# EAGLE design PhoneGimbal_v3 (EAGLE 9.6.2)
AUTHOR: RMCLAUGLHIN & MFROST; BOARD_NAME: GIMBAL; DOC_NUM: 02; PROJECT_NAME: 507_FINAL; REVISION: 02
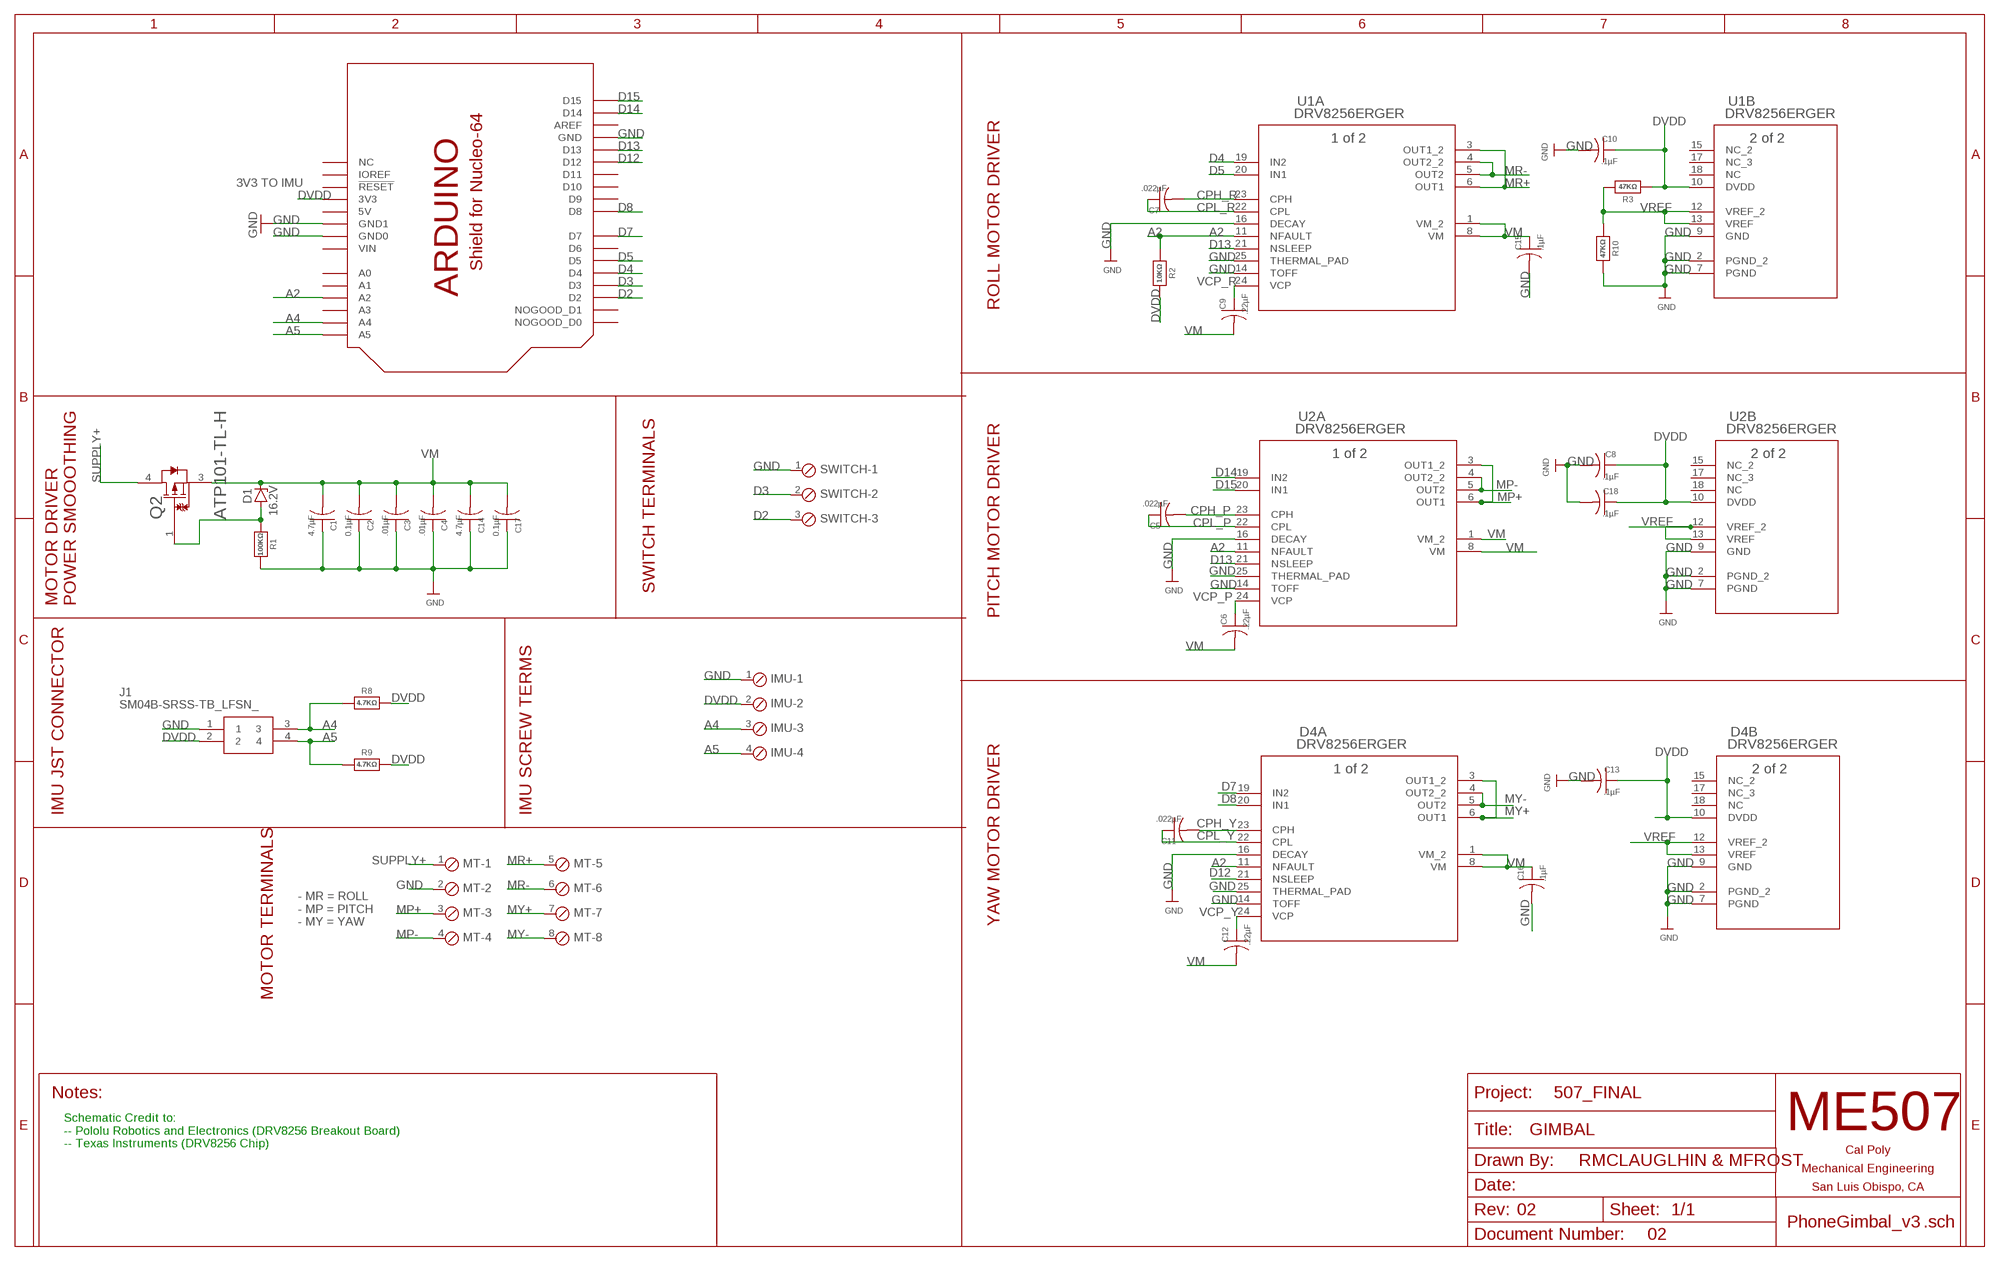
[diagram p0: schematic, sheet 1]

## Parts
C1  4.7µF  C-USC0805  [C0805]
C2  0.1µF  C-USC0805  [C0805]
C3  .01µF  C-USC0805  [C0805]
C4  .01µF  C-USC0805  [C0805]
C5  .022µF  C-USC0805  [C0805]
C6  .22µF  C-USC0805  [C0805]
C7  .022µF  C-USC0805  [C0805]
C8  .1µF  C-USC0805  [C0805]
C9  .22µF  C-USC0805  [C0805]
C10  .1µF  C-USC0805  [C0805]
C11  .022µF  C-USC0805  [C0805]
C12  .22µF  C-USC0805  [C0805]
C13  .1µF  C-USC0805  [C0805]
C14  4.7µF  C-USC0805  [C0805]
C15  .1µF  C-USC0805  [C0805]
C16  .1µF  C-USC0805  [C0805]
C17  0.1µF  C-USC0805  [C0805]
C18  .1µF  C-USC0805  [C0805]
D1  16.2V  ZENER-DIODEDO34-7  [DO34Z7]
D4  DRV8256ERGER  [VQFN_6PRGER_TEX]
IMU  SCREWTERM_4P_254  [4POL254]
J1  SM04B-SRSS-TB_LFSN_  [SM04B-SRSS-TB(LFSN)]
MT  SCREWTERM_8P_381  [8POL381]
Q2  ON_SEMICONDUCTOR_ATP101-TL-HON_SEMICONDUCTOR_ATP101-TL-H_0_0  [ON_SEMICONDUCTOR_ATP101-TL-H_0]
R1  100KΩ  RESISTOR_1206  [_1206]
R2  10KΩ  RESISTOR_1206  [_1206]
R3  47KΩ  RESISTOR_1206  [_1206]
R8  4.7KΩ  RESISTOR_1206  [_1206]
R9  4.7KΩ  RESISTOR_1206  [_1206]
R10  47KΩ  RESISTOR_1206  [_1206]
SWITCH  SCREWTERM_3P_254  [3POL254]
U1  DRV8256ERGER  [VQFN_6PRGER_TEX]
U2  DRV8256ERGER  [VQFN_6PRGER_TEX]
U$1  SHIELD_FOR_NUCLE0_64_STANDARD  [SHIELD_FOR_NUCLEO_64_STD]

## Nets
A2: D4.11(A:NFAULT) R2.1 U1.11(A:NFAULT) U2.11(A:NFAULT) U$1.A2
A4: IMU.3 J1.3 R8.1 U$1.A4
A5: IMU.4 J1.4 R9.1 U$1.A5
CPH_P: C5.2 U2.23(A:CPH)
CPH_R: C7.2 U1.23(A:CPH)
CPH_Y: C11.2 D4.23(A:CPH)
CPL_P: C5.1 U2.22(A:CPL)
CPL_R: C7.1 U1.22(A:CPL)
CPL_Y: C11.1 D4.22(A:CPL)
D2: SWITCH.3 U$1.D2
D3: SWITCH.2 U$1.D3
D4: U1.19(A:IN2) U$1.D4
D5: U1.20(A:IN1) U$1.D5
D7: D4.19(A:IN2) U$1.D7
D8: D4.20(A:IN1) U$1.D8
D12: D4.21(A:NSLEEP) U$1.D12
D13: U1.21(A:NSLEEP) U2.21(A:NSLEEP) U$1.D13
D14: U2.19(A:IN2) U$1.D14
D15: U2.20(A:IN1) U$1.D15
DVDD: C8.1 C10.1 C13.1 C18.1 D4.10(B:DVDD) IMU.2 J1.2 R2.2 R3.1 R8.2 R9.2 U1.10(B:DVDD) U2.10(B:DVDD) U$1.3V(3V3)
GND: C1.1 C2.1 C3.1 C4.1 C8.2 C10.2 C13.2 C14.1 C15.2 C16.2 C17.1 C18.2 D4.2(B:PGND_2) D4.7(B:PGND) D4.9(B:GND) D4.14(A:TOFF) D4.16(A:DECAY) D4.25(A:THERMAL_PAD) IMU.1 J1.1 MT.2 R1.2 R10.2 SWITCH.1 U1.2(B:PGND_2) U1.7(B:PGND) U1.9(B:GND) U1.14(A:TOFF) U1.16(A:DECAY) U1.25(A:THERMAL_PAD) U2.2(B:PGND_2) U2.7(B:PGND) U2.9(B:GND) U2.14(A:TOFF) U2.16(A:DECAY) U2.25(A:THERMAL_PAD) U$1.GND U$1.GND1(GND0) U$1.GND2(GND1)
MP+: MT.3 U2.3(A:OUT1_2) U2.6(A:OUT1)
MP-: MT.4 U2.4(A:OUT2_2) U2.5(A:OUT2)
MR+: MT.5 U1.3(A:OUT1_2) U1.6(A:OUT1)
MR-: MT.6 U1.4(A:OUT2_2) U1.5(A:OUT2)
MY+: D4.3(A:OUT1_2) D4.6(A:OUT1) MT.7
MY-: D4.4(A:OUT2_2) D4.5(A:OUT2) MT.8
N$1: D1.A Q2.1(G) R1.1
SUPPLY+: MT.1 Q2.4(D)
VCP_P: C6.1 U2.24(A:VCP)
VCP_R: C9.1 U1.24(A:VCP)
VCP_Y: C12.1 D4.24(A:VCP)
VM: C1.2 C2.2 C3.2 C4.2 C6.2 C9.2 C12.2 C14.2 C15.1 C16.1 C17.2 D1.C D4.1(A:VM_2) D4.8(A:VM) Q2.3(S) U1.1(A:VM_2) U1.8(A:VM) U2.1(A:VM_2) U2.8(A:VM)
VREF: D4.12(B:VREF_2) D4.13(B:VREF) R3.2 R10.1 U1.12(B:VREF_2) U1.13(B:VREF) U2.12(B:VREF_2) U2.13(B:VREF)
Unconnected: D4.15(B:NC_2) D4.17(B:NC_3) D4.18(B:NC) U1.15(B:NC_2) U1.17(B:NC_3) U1.18(B:NC) U2.15(B:NC_2) U2.17(B:NC_3) U2.18(B:NC) U$1.A0 U$1.A1 U$1.A3 U$1.AREF U$1.D0(NOGOOD_D0) U$1.D1(NOGOOD_D1) U$1.D6 U$1.D9 U$1.D10 U$1.D11 U$1.IOREF U$1.NC U$1.NRST(!RESET)

## Notes on the sheet
- 3V3 TO IMU
- ROLL MOTOR DRIVER
- SWITCH TERMINALS
- MOTOR DRIVER
  POWER SMOOOTHING
- PITCH MOTOR DRIVER
- IMU JST CONNECTOR | IMU SCREW TERMS
- - MR = ROLL
  - MP = PITCH
  - MY = YAW
- YAW MOTOR DRIVER
- MOTOR TERMINALS
- Schematic Credit to:
  -- Pololu Robotics and Electronics (DRV8256 Breakout Board)
  -- Texas Instruments (DRV8256 Chip)

## Power pins joined to a net without a drawn wire
5V: U$1.5V
VIN: U$1.VIN

## Library data of the parts
C1-C18 = rcl:C-US: CAPACITOR, American symbol; SPICEPREFIX: C
D1 = diode:ZENER-DIODE: Z-Diode
D4 U1 U2 = DRV8256_TI:DRV8256ERGER; BUILT_BY: EMA_Matt; COPYRIGHT: Copyright (C) 2018 Accelerated Designs. All rights reserved; DATASHEET: https://www.ti.com/lit/ds/symlink/drv8256.pdf?ts=1624033284390&ref_url=https%253A%252F%252Fwww.google.com%252F; MANUFACTURER_PART_NUMBER: DRV8256ERGER; SOURCELIBRARY: Add_to_database_2021-06-21; VENDOR: Texas Instruments
IMU = ME507_1:SCREWTERM_4P: Screw Terminal Block This part is designed for a screw terminal connector. The 2.54mm (0.100 inch) foorprint can also be used for male or female pin headers such as those on most development boards. One can also solder wires directly into the holes, though this makes modifications or repairs to the system more inconvenient. Larger versions can carry more current.
J1 = SM04B-SRSS-TB_LFSN_:SM04B-SRSS-TB_LFSN_: 4 way side entry SMT header,1mm pitch JST SH Series, 1mm Pitch 4 Way 1 Row Right Angle PCB Header, Solder Termination, 1A Source: Datasheet <http://docs-emea.rs-online.com/webdocs/05b0/0900766b805b098a.pdf>; DESCRIPTION: 4 way side entry SMT header,1mm pitch JST SH Series, 1mm Pitch 4 Way 1 Row Right Angle PCB Header, Solder Termination, 1A; HEIGHT: mm; MANUFACTURER_NAME: JST (JAPAN SOLDERLESS TERMINALS); MANUFACTURER_PART_NUMBER: SM04B-SRSS-TB(LFSN)
MT = ME507_2:SCREWTERM_8P: Screw Terminal Block This part is designed for a screw terminal connector. The 2.54mm (0.100 inch) foorprint can also be used for male or female pin headers such as those on most development boards. One can also solder wires directly into the holes, though this makes modifications or repairs to the system more inconvenient. Larger versions can carry more current.
Q2 = On Semiconductor - ATP101-TL-H:ON_SEMICONDUCTOR_ATP101-TL-H: ONSC-PMOS-G1S3D4-3; CHANNEL_POLARITY: P Channel; CIIVA_IDS: 837410; CISS_TYP_PF: 875; COMPONENT_LINK_1_DESCRIPTION: Manufacturer URL; COMPONENT_LINK_1_URL: http://www.onsemi.com/; COMPONENT_LINK_3_DESCRIPTION: Package Specification; COMPONENT_LINK_3_URL: http://www.onsemi.com/pub_link/Collateral/369AM.PDF; CONFIGURATION: Single; COSS_TYP_PF: 220; CRSS_TYP_PF: 155; DATASHEET: http://www.onsemi.com/pub_link/Collateral/ENA1646-D.PDF; FOOTPRINT_VARIANT_NAME_0: Manufacturer Recommended; ID_MAX_A: 25; IMPORTED: yes; IMPORTED_FROM: vault; IMPORT_TS: 1521856203; MF: On Semiconductor; MOUNTING_TECHNOLOGY: Surface Mount; MPN: ATP101-TL-H; PACKAGE: ATPAK-3-369AM; PACKAGE_DESCRIPTION: 3-Pin Flange Mount, Body 6.5 x 7.3 mm, Pitch 2.3 mm; PACKAGE_TYPE: DPAK (Single Gauge) / ATPAK; PACKAGE_VERSION: Rev. O, 02/2012; PACKING: Tape and Reel; PD_MAX_W: 30; PREFIX: Q; RELEASE_DATE: 1407149285; ROHS: No; VAULT_GUID: 079080CD-2949-45C9-A0CF-7F17EC955C1A; VAULT_REVISION: 0AC2FBEC-EBD1-4D7E-AF0A-6AD1731BE4C4; VBRDSS_MIN_V: 30; VGSTH_MAX_V: 2.6; VGS_MAX_V: 20
R1-R3 R8-R10 = microbuilder:RESISTOR: Resistors For new designs, use the packages preceded by an '_' character since they are more reliable: The following footprints should be used on most boards: _0402 - Standard footprint for regular board layouts _0603 - Standard footprint for regular board layouts _0805 - Standard footprint for regular board layouts _1206 - Standard footprint for regular board layouts For extremely tight-pitch boards where space is at a premium, the following 'micro-pitch' footprints can be used (smaller pads, no silkscreen outline, etc.): _0402MP - Micro-pitch footprint for very dense/compact boards _0603MP - Micro-pitch footprint for very dense/compact boards _0805MP - Micro-pitch footprint for very dense/compact boards _1206MP - Micro-pitch footprint for very dense/compact boards
SWITCH = ME507_1:SCREWTERM_3P: Screw Terminal Block This part is designed for a screw terminal connector. The 2.54mm (0.100 inch) foorprint can also be used for male or female pin headers such as those on most development boards. One can also solder wires directly into the holes, though this makes modifications or repairs to the system more inconvenient. Larger versions can carry more current.
U$1 = ME507_2:SHIELD_FOR_NUCLE0_64: Arduino Style Shield for Nucleo-64 This is a board outline with pin locations for an Arduino style shield which fits on top of an STM32 Nucleo-64. Pin names are generic except for Nucleo specific pins such as IOREF. There are two board sizes, the standard which matches the size of an Arduino Uno, and the short version which can be less expensive to produce if you don't need a lot of board area. The outline is on the DIMENSION layer. When making a new board, you must delete the lines which form the default board outline so that this package's outlines control the dimensions of the board. Pins D0 and D1 are connected to a communications port and are not available for general use, so they are labeled as NOGOOD on the symbol and footprints.

## Board
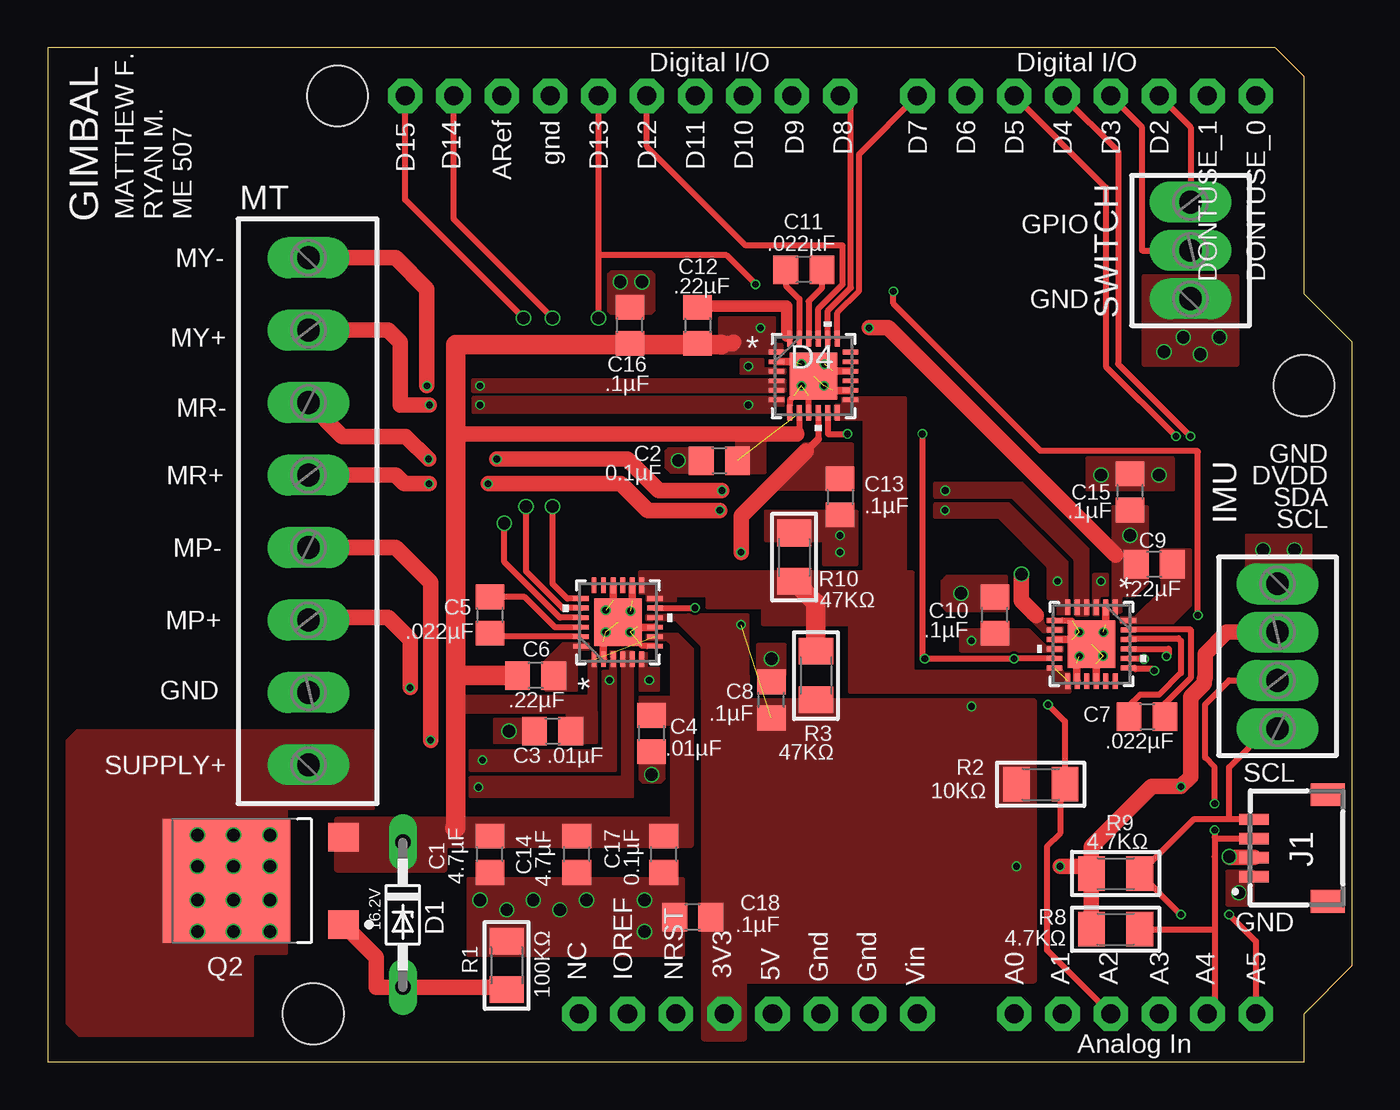
[diagram p1: board, top side]
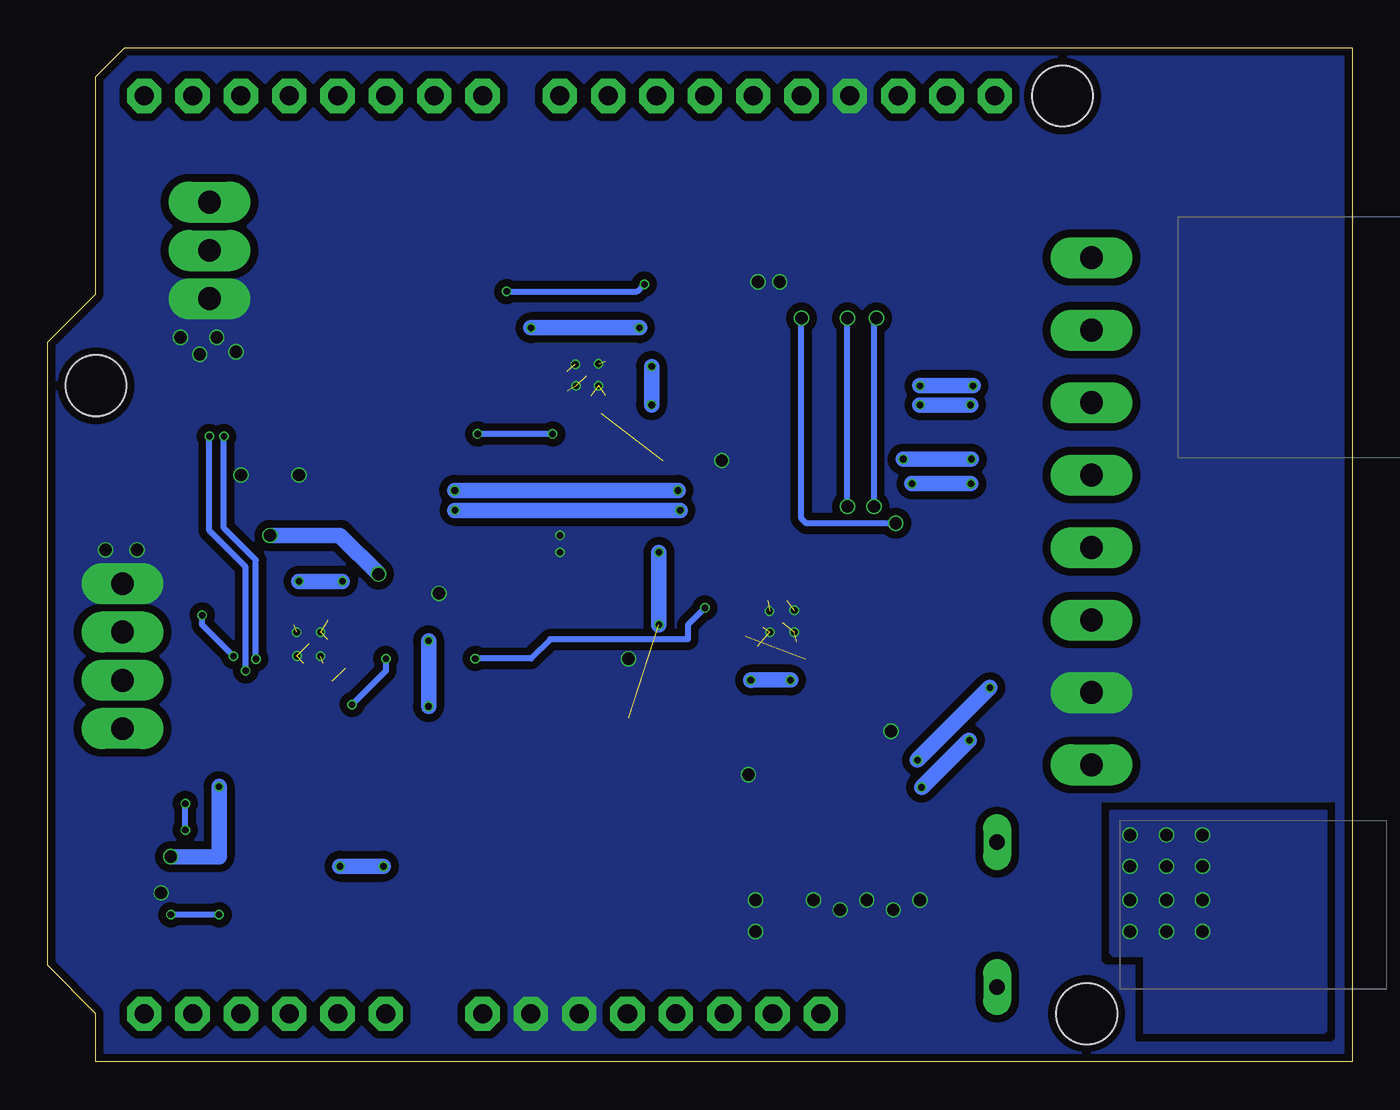
[diagram p2: board, bottom side, seen from below]

Size 68.58 x 53.34 mm. Coordinates in mm from the lower left corner, seen from the top.
Copper layers (1*16): Top 0.035mm / dielectric 1.6mm / Bottom 0.035mm
Design rules "jlcpcb-2layers": minimum track width 5mil, minimum drill 0.3mm, track to track 5mil, track to pad 5mil, pad to pad 5mil, via to via 5mil, smd to smd 5mil, copper to edge 0.2mm, drill to drill 6mil, minimum pad ring 10mil, minimum via ring 3mil, stop-mask expansion 4mil, vias tented up to drill 0mil, thermal gap 10mil

### Footprints (pad centres in the part's own frame; a part is rotated, then mirrored left to right if it is on the bottom)
C0805 = smd 1.3 x 1.5: 1 -0.95,0; 2 0.95,0
DO34Z7 = drill 0.813 long: A 3.81,0; C -3.81,0
VQFN_6PRGER_TEX = smd 0.813 x 0.254: 1 -1.943,1.25; 2 -1.943,0.75; 3 -1.943,0.25; 4 -1.943,-0.25; 5 -1.943,-0.75; 6 -1.943,-1.25; 13 1.943,-1.25; 14 1.943,-0.75; 15 1.943,-0.25; 16 1.943,0.25; 17 1.943,0.75; 18 1.943,1.25 | smd 0.254 x 0.813: 7 -1.25,-1.943; 8 -0.75,-1.943; 9 -0.25,-1.943; 10 0.25,-1.943; 11 0.75,-1.943; 12 1.25,-1.943; 19 1.25,1.943; 20 0.75,1.943; 21 0.25,1.943; 22 -0.25,1.943; 23 -0.75,1.943; 24 -1.25,1.943 | smd 2.489 x 2.489: 25 0,0
4POL254 = drill 1.2 long: 1 -3.81,0; 2 -1.27,0; 3 1.27,0; 4 3.81,0
SM04B-SRSS-TB(LFSN) = smd 0.6 x 1.55: 1 1.5,4.661; 2 2.5,4.661; 3 3.5,4.661; 4 4.5,4.661 | smd 1.2 x 1.8: 5 0.2,0.786; 6 5.8,0.786
8POL381 = drill 1.2 long: 1 -13.335,0; 2 -9.525,0; 3 -5.715,0; 4 -1.905,0; 5 1.905,0; 6 5.715,0; 7 9.525,0; 8 13.335,0
ON_SEMICONDUCTOR_ATP101-TL-H_0 = smd 1.6 x 1.5: 1 -6.15,2.3; 3 -6.15,-2.3 | smd 6.7 x 6.5: 4 0,0
_1206 = smd 1.4 x 1.8: 1 -1.27,0; 2 1.27,0
3POL254 = drill 1.2 long: 1 -2.54,0; 2 0,0; 3 2.54,0
SHIELD_FOR_NUCLEO_64_STD = drill 1 pad 1.676 octagon: 3V 35.56,2.54; 5V 38.1,2.54; A0 50.8,2.54; A1 53.34,2.54; A2 55.88,2.54; A3 58.42,2.54; A4 60.96,2.54; A5 63.5,2.54; AREF 23.876,50.8; D0 63.5,50.8; D1 60.96,50.8; D2 58.42,50.8; D3 55.88,50.8; D4 53.34,50.8; D5 50.8,50.8; D6 48.26,50.8; D7 45.72,50.8; D8 41.656,50.8; D9 39.116,50.8; D10 36.576,50.8; D11 34.036,50.8; D12 31.496,50.8; D13 28.956,50.8; D14 21.336,50.8; D15 18.796,50.8; GND 26.416,50.8; GND1 43.18,2.54; GND2 40.64,2.54; IOREF 30.48,2.54; NC 27.94,2.54; NRST 33.02,2.54; VIN 45.72,2.54 | hole 3.2: 15.24,50.8; 66.04,35.56; 13.97,2.54

### Placement (x,y rotation side)
C1  23.24,10.92 90 top
C2  35.31,31.62 0 top
C3  26.54,17.4 0 top
C4  31.75,17.27 90 top
C5  23.24,23.5 270 top
C6  25.65,20.32 180 top
C7  57.78,18.16 0 top
C8  38.04,19.04 90 top
C9  58.17,26.16 180 top
C10  49.78,23.5 90 top
C11  39.75,41.66 180 top
C12  34.16,38.73 270 top
C13  41.66,29.72 270 top
C14  27.81,10.92 90 top
C15  56.9,29.97 90 top
C16  30.61,38.73 90 top
C17  32.38,10.92 90 top
C18  33.91,7.62 180 top
D1  18.67,7.75 270 top
D4  40.26,36.07 0 top
IMU  64.64,21.34 270 top
J1  68.07,8.26 90 top
MT  13.72,28.96 90 top
Q2  9.4,9.53 180 top
R1  24.13,5.08 90 top
R2  52.2,14.61 180 top
R3  40.39,20.32 90 top
R8  56.13,6.99 180 top
R9  56.13,9.91 180 top
R10  39.24,26.54 90 top
SWITCH  60.07,42.67 90 top
U1  54.86,21.97 270 top
U2  29.97,23.11 90 top
U$1  0,0 0 top

### Tracks (layer width: path | path; a pad name or v marks a point on that pad's centre or on a via)
A2  (via drill 0.35)
  Top 0.305: U2.11 31.93,23.88 v34.04,23.88 | 50.81,21.22 v50.8,21.21 | D4.11 41.01,33.02 v42.04,33.02 | v45.97,33.02 45.97,21.34 v46.1,21.21 46.11,21.22 50.81,21.22 | v52.58,18.8 53.47,17.91 R2.1 53.21,14.35 53.21,12.02 52.53,11.33 52.53,5.89 U$1.A2 | U1.11 50.81,21.22
  Bottom 0.305: v42.04,33.02 v45.97,33.02 | v34.04,23.88 34.92,22.99 34.92,22.23 42.16,22.23 43.18,21.21 v46.1,21.21 | v50.8,21.21 50.8,20.57 v52.58,18.8
A4  (via drill 0.35)
  Top 0.305: v61.34,12.2 61.34,11.81 | 61.34,11.81 61.34,10.79 61.34,6.99 | R8.1 61.34,6.99 | IMU.3 62.1,20.07 60.83,18.8 60.83,16 61.34,15.49 v61.34,13.59 | 61.34,6.99 61.34,2.92 U$1.A4 | 61.34,11.81 61.4,11.76 J1.3
  Bottom 0.305: v61.34,12.2 v61.34,13.59
A5  (via drill 0.35)
  Top 0.305: 62.1,12.78 60.27,12.78 R9.1 v59.56,7.75 | 62.1,12.78 62.1,15.49 64.14,17.53 IMU.4 | v62.1,7.75 63.5,6.35 U$1.A5 | 62.1,12.78 63.39,12.78 J1.4
  Bottom 0.305: v62.1,7.75 v62.09,7.76 59.58,7.76 v59.56,7.75
CPH_P
  Top 0.305: C5.2 23.42,22.36 U2.23
CPH_R
  Top 0.305: U1.23 56.82,22.73 60.07,22.73 60.07,20.19 58.73,18.86 C7.2
CPH_Y
  Top 0.305: C11.2 38.8,40.83 39.51,40.12 D4.23
CPL_P
  Top 0.305: U2.22 26.67,22.86 25.09,24.45 C5.1
CPL_R
  Top 0.305: U1.22 56.85,22.26 57,22.26 57.01,22.28 59.44,22.28 59.56,22.15 59.56,20.45 58.42,19.3 57.4,19.3 56.84,18.73 C7.1
CPL_Y
  Top 0.305: C11.1 40.7,40.7 40.01,40.01 D4.22
D2
  Top 0.305: U$1.D2 60.07,49.15 SWITCH.3
D3
  Top 0.305: SWITCH.2 57.53,42.67 57.53,49.15 U$1.D3
D4  (via drill 0.35)
  Top 0.305: U1.19 57.12,20.72 57.19,20.66 58.08,20.66 v58.17,20.57 | v60.07,32.89 56.26,36.7 56.26,47.88 U$1.D4
  Bottom 0.305: v60.07,32.89 60.07,27.94 58.17,26.04 v58.17,20.57
D5  (via drill 0.35)
  Top 0.305: U1.20 57.4,21.22 57.6,21.22 v57.63,21.19 | v59.31,32.89 55.63,36.58 55.63,45.97 U$1.D5
  Bottom 0.305: v57.63,21.19 57.63,26.39 59.31,28.07 v59.31,32.89
D7
  Top 0.305: D4.19 41.51,39.4 42.65,40.54 42.65,47.73 U$1.D7
D8
  Top 0.305: D4.20 41.01,39.51 42.22,40.72 42.22,50.24 U$1.D8
D12
  Top 0.305: D4.21 40.51,39.62 41.78,40.89 41.78,42.93 36.7,42.93 31.5,48.13 U$1.D12
D13  (via drill 0.35, 0.65)
  Top 0.305: U2.21 26.93,23.36 24,26.29 v24,28.32 | v28.96,39.12 28.96,42.42 | 28.96,42.42 U$1.D13 | v44.45,40.51 44.45,39.88 52.2,32.13 60.4,32.13 60.45,32.08 v60.45,23.5 | v37.21,40.89 35.69,42.42 28.96,42.42 | U1.21 58.92,21.72 58.93,21.72 58.93,21.46 v58.8,21.34
  Bottom 0.305: v24,28.32 28.7,28.32 28.96,28.57 v28.96,39.12 | v44.45,40.51 37.59,40.51 v37.21,40.89 | v58.8,21.34 60.45,22.99 v60.45,23.5
D14  (via drill 0.65)
  Top 0.305: U2.19 27.32,24.36 26.54,25.15 v26.54,29.21 | v26.54,39.12 21.34,44.32 U$1.D14
  Bottom 0.305: v26.54,29.21 v26.54,39.12
D15  (via drill 0.65)
  Top 0.305: U2.20 27.07,23.86 25.15,25.79 v25.15,29.21 | v25.02,39.12 18.8,45.34 U$1.D15
  Bottom 0.305: v25.02,39.12 25.15,38.99 v25.15,29.21
DVDD  (via drill 0.35, 0.65)  (1 unrouted)
  Top 0.305: D4.10 40.51,32.76
  Top 0.406: 40.51,32.76 39.88,32.13
  Top 0.813: 39.88,32.13 36.45,28.7 v36.45,26.8 | IMU.2 61.98,22.61 60.83,21.46 60.83,20.19 60.78,20.14 60.78,19.9 60.07,19.19 60.07,14.99 v59.56,14.48 58.04,14.48 54.86,11.3 R9.2 | R9.2 54.48,10.29 v53.21,10.29 | R8.2 R9.2 | J1.2 62.14,10.76 v62.1,10.79
  Bottom 0.813: v36.45,26.8 v36.45,22.99 | v48.55,22.15 v48.55,18.69 | v59.56,14.48 59.56,10.79 v62.1,10.79 | v53.21,10.29 v50.93,10.29
  pour Top (no thermals): 36.58,1.27 34.54,1.27 34.54,18.92 51.82,18.92 51.82,4.32 36.58,4.32
  pour Top (no thermals): 31.5,23.5 33.66,23.5 36.83,20.32 36.83,19.05 34.42,19.05 34.42,21.84 33.02,23.24 31.5,23.24
  pour Top (no thermals): 53.34,21.84 53.34,21.59 48.01,21.59 48.01,22.73 51.56,22.73 52.45,21.84
  pour Top: 36.83,23.5 33.66,23.5 36.83,20.32
  pour Top (no thermals): 42.29,32.51 42.29,30.1 37.34,30.1 39.75,32.51
GND  (via drill 0.35, 0.65)  (18 unrouted)
  Top 0.305: 31.24,21.88 31.48,21.88 31.49,21.86 U2.7 | U1.7 53.34,23.22 53.36,23.2 53.85,23.2 | D4.7 39.01,34.55 39.03,34.56 39.03,34.84 39.24,35.05 | D4.9 40.01,35.05
  Top 0.406: 30.99,22.86 U2.9 | U2.2 29.21,21.18 29.21,22.1 | U1.2 55.63,23.9 55.63,22.99 | D4.2 39.24,36.83 | U1.9 53.85,22.23 | U2.16 29.72,24.26 | U2.14 30.72,24.27 | U1.14 54.1,20.95 | U1.16 55.11,20.95 55.12,20.95 | D4.14 42.19,35.31 41.27,35.31 | D4.16 41.28,36.32 41.27,36.32
  Top 0.508: 29.72,24.26 | 30.72,24.27 30.73,24.26
  other vias: 22.73,8.51 25.53,8.51 24.13,8 48.01,24.64 41.66,27.69 41.66,26.8 39.62,36.7 40.84,36.69 39.62,35.56 40.81,35.56 54.23,22.61 55.49,22.61 55.47,21.35 54.23,21.34 30.63,23.71 30.62,22.61 29.34,22.61 29.34,23.75 55.37,30.86 58.42,30.86 30.1,41.02 31.24,41.02 63.88,26.92 65.53,26.92 62.61,8.89 59.69,38.1 58.67,37.34 61.59,38.1 60.58,37.21 38.05,21.2 31.75,15.11 24.26,17.4 33.15,31.62 26.92,8 28.32,8.51 31.37,8.51 31.37,6.86
  pour Bottom (isolate 0.406, rank 2, no thermals): 0,53.34 64.77,53.34 66.04,52.07 66.04,40.64 68.58,38.1 68.58,5.08 66.04,2.54 66.04,0 0,0
  pour Top (no thermals): 22.1,9.65 33.4,9.65 33.4,5.59 22.1,5.59
  pour Top (no thermals): 37.72,28.96 37.72,27.43 40.77,27.43 40.77,26.16 42.55,26.16 42.55,28.96
  pour Top (no thermals): 54.61,31.75 54.61,30.1 59.18,30.1 59.18,31.75
  pour Top (no thermals): 63.37,24.38 65.91,24.38 66.42,24.89 66.42,27.69 62.99,27.69 62.99,24.77 63.12,24.77 63.37,24.51
  pour Top (no thermals): 57.66,41.27 62.48,41.27 62.48,36.7 57.66,36.7
  pour Top (no thermals): 50.42,24.51 50.42,25.53 47.24,25.53 46.99,25.27 46.99,24 47.24,23.75 50.42,23.75
  pour Top (no thermals): 37.34,20.32 37.34,21.97 38.73,21.97 38.73,20.32
  pour Top (no thermals): 31.11,16.13 31.11,14.86 31.24,14.73 32.26,14.73 32.41,14.88 32.41,16.13
  pour Top (no thermals): 23.5,18.03 25.91,18.03 25.91,16.76 23.5,16.76
  pour Top (no thermals): 34.67,32.26 34.67,30.99 32.77,30.99 32.51,31.24 32.51,32.13 32.64,32.26
  pour Top (no thermals): 63.37,10.03 61.98,10.03 61.98,8.26 63.37,8.26
  pour Top (no thermals): 29.46,41.4 29.46,39.5 29.59,39.37 31.75,39.37 31.88,39.5 31.88,41.4 31.75,41.53 29.59,41.53
MP+  (via drill 0.35)
  Top 0.813: MT.3 13.84,23.37 17.91,23.37 19.05,22.23 v19.05,19.68
  Bottom 0.813: v22.86,15.88 v19.05,19.68 | v29.53,20.08 v31.61,20.08 v31.62,20.07
  pour Top (no thermals): 29.59,21.59 29.84,21.59 29.84,15.32 22.23,15.32 22.23,16.38 29.21,16.38 29.21,20.57 29.59,20.57
  pour Top (no thermals): 31.11,21.46 31.11,19.56 32.13,19.56 32.13,20.7 31.5,20.7 31.5,21.46
MP-  (via drill 0.35)
  Top 0.813: MT.4 18.29,27.05 20.13,25.21 v20.13,16.92
  Bottom 0.813: v22.64,14.44 20.17,16.92 v20.13,16.92
  pour Top (no thermals): 22.23,14.99 30.23,14.99 30.23,21.59 30.73,21.59 30.73,13.93 22.23,13.93
MR+  (via drill 0.35)
  Top 0.813: v35.33,29.01 31.53,29.01 30.14,30.4 v23.15,30.4 | v20.05,30.4 18.75,30.4 18.29,30.86 MT.5
  Bottom 0.813: v53.09,25.27 v55.37,25.27 | v47.17,29.01 v35.33,29.01 | v23.15,30.4 v20.05,30.4
  pour Top (no thermals): 55.24,23.5 54.99,23.5 54.99,25.65 55.7,25.65 55.7,24.51 55.24,24.51
  pour Top (no thermals): 53.59,23.5 53.59,26.29 50.55,29.34 46.61,29.34 46.61,28.65 49.96,28.65 52.58,26.04 52.58,24.38 53.09,24.38 53.09,23.5
MR-  (via drill 0.35)
  Top 0.813: v35.45,30.05 32.12,30.05 30.47,31.7 v23.61,31.7 | v20.03,31.7 18.83,32.89 15.49,32.89 MT.6
  Bottom 0.813: v47.18,30.05 v35.45,30.05 | v23.61,31.7 v20.03,31.7
  pour Top (no thermals): 53.98,23.5 54.69,23.5 54.69,26.97 51.24,30.42 46.61,30.42 46.61,29.72 50.67,29.72 53.98,26.42
MY+  (via drill 0.35)
  Top 0.813: MT.7 17.91,38.48 18.54,37.85 18.54,34.54 v20.07,34.54
  Bottom 0.813: v36.83,36.58 v36.83,34.54 | v20.07,34.54 v22.73,34.54
  pour Top (no thermals): 38.73,36.45 38.73,36.2 36.45,36.2 36.45,36.96 37.59,36.96 37.59,36.45
  pour Top (no thermals): 38.73,34.92 22.35,34.92 22.35,34.16 37.97,34.16 37.97,34.54 38.73,34.54
MY-  (via drill 0.35)
  Top 0.813: MT.8 18.29,42.29 19.94,40.64 v19.94,35.56
  Bottom 0.813: v19.94,35.56 v22.73,35.56
  pour Top (no thermals): 38.73,35.89 38.73,35.23 22.35,35.23 22.35,35.89
N$1
  Top 0.813: R1.1 24,3.94 D1.A 17.27,3.94 17.27,5.5 Q2.1
SUPPLY+  (via drill 0.65)
  other vias: 7.87,11.94 9.78,11.94 11.68,11.94 11.68,10.29 11.68,8.51 11.68,6.86 9.78,6.86 7.87,6.86 7.87,8.51 9.78,8.51 9.78,10.29 7.87,10.29
  pour Top (no thermals): 17.14,17.4 1.52,17.4 1.02,16.89 1.02,2.03 1.65,1.4 10.79,1.4 10.79,5.59 10.92,5.71 12.57,5.71 12.57,13.34 17.14,13.34
  pour Bottom (no thermals): 1.52,1.52 10.92,1.52 10.92,5.59 12.57,5.59 12.7,5.71 12.7,13.21 1.4,13.21 1.4,1.65
VCP_P
  pour Top (no thermals): 26.16,19.56 27.81,19.56 27.81,21.46 28.07,21.72 28.45,21.72 28.45,21.97 27.05,21.97 26.16,21.08
VCP_R
  pour Top (no thermals): 56.39,23.34 56.39,23.11 59.18,23.11 60.07,24 60.07,26.92 58.55,26.92 58.55,24.77 57.12,23.34
VCP_Y
  Top 0.305: D4.24 38.86,38.16
  Top 0.61: 38.86,38.16 38.86,39.75 34.23,39.75 C12.1
VM  (via drill 0.35, 0.65)  (2 unrouted)
  Top 0.305: D4.8 39.51,33.16
  Top 0.508: 39.51,33.16 39.37,33.02
  Top 0.813: 39.37,33.02 21.46,33.02 | v43.18,38.61 44.2,38.61 56.13,26.67 | v51.18,25.65 51.18,24.27 51.97,23.48 | C16.1 C12.2 36.01,37.78 36.07,37.85
  Top 1.016: 21.4,12.32 21.46,12.32 21.46,20.32 | 21.46,20.32 21.46,33.02 21.46,37.72 35.43,37.72 | C6.2 21.46,20.32
  Bottom 0.813: v37.47,38.61 v43.18,38.61 | v51.18,25.65 53.21,27.69 v56.9,27.69
  pour Top (no thermals): 15.24,10.16 15.24,12.7 33.78,12.7 33.78,11.43 20.83,11.43 20.83,10.16
  pour Top (no thermals): 28.7,21.46 28.7,21.08 28.45,21.08 28.45,19.23 21.72,19.23 21.72,18.41 28.83,18.41 28.83,21.46
  pour Top (no thermals): 31.5,22.48 31.5,22.23 32.51,22.23 32.77,21.97 32.77,12.7 33.91,12.7 33.91,21.72 33.15,22.48
  pour Top (no thermals): 56.01,23.65 56.01,29.21 57.78,29.21 57.78,25.15 57.15,24.51 56.4,24.51 56.4,23.65
  pour Top (no thermals): 38.61,37.27 38.61,37.72 38.35,37.72 38.23,37.85 38.23,39.12 35.31,39.12 35.31,37.27
  pour Top (no thermals): 53.34,22.86 53.34,22.61 52.32,22.61 51.56,23.37 51.56,23.62 52.29,23.62 52.29,23.15 52.58,22.86
  pour Top (no thermals): 32.77,19.18 31.11,19.18 31.11,17.78 32.77,17.78
  pour Top (no thermals): 28.83,18.41 28.83,16.76 27.3,16.76 27.3,18.41
  pour Top (no thermals): 36.2,32.64 36.2,30.99 37.72,30.99 37.72,32.64
VREF  (1 unrouted)
  Top 1.016: R10.1 40.39,24.13 R3.2
  pour Top (no thermals): 31.11,24.64 31.11,25.78 39.5,25.78 39.5,23.88 34.67,23.88 34.67,24.51 31.62,24.51 31.62,24.64
  pour Top (no thermals): 53.34,20.57 53.34,20.45 53.72,20.45 53.72,19.43 42.16,19.43 42.16,22.99 37.59,22.99 37.59,25.78 45.47,25.78 45.47,20.57
  pour Top (no thermals): 31.5,24.64 31.5,24.26 33.02,24.26 33.02,24.64
  pour Top (no thermals): 41.4,34.54 41.78,34.54 41.78,34.92 45.09,34.92 45.09,24 42.93,24 42.93,33.78 41.4,33.78

### Text on the board
tNames: GPIO | GIMBAL | MATTHEW F. / RYAN M. / ME 507 | MY- | GND | MY+ | MR- | GND | MR+ | DVDD | SDA | SCL | MP- | MP+ | GND | SUPPLY+ | SCL | GND